# Altium schematic sheet XOR_LCD.SchDoc: XOR_LCD LCD Biasing Circuit
size B; DocumentNumber: 2; SheetNumber: 2; SheetTotal: 2; Address1: L3, 12a Rodborough Rd; Address2: Frenchs Forest; Address3: NSW; Address4: Australia 2086; Organization: Altium Limited
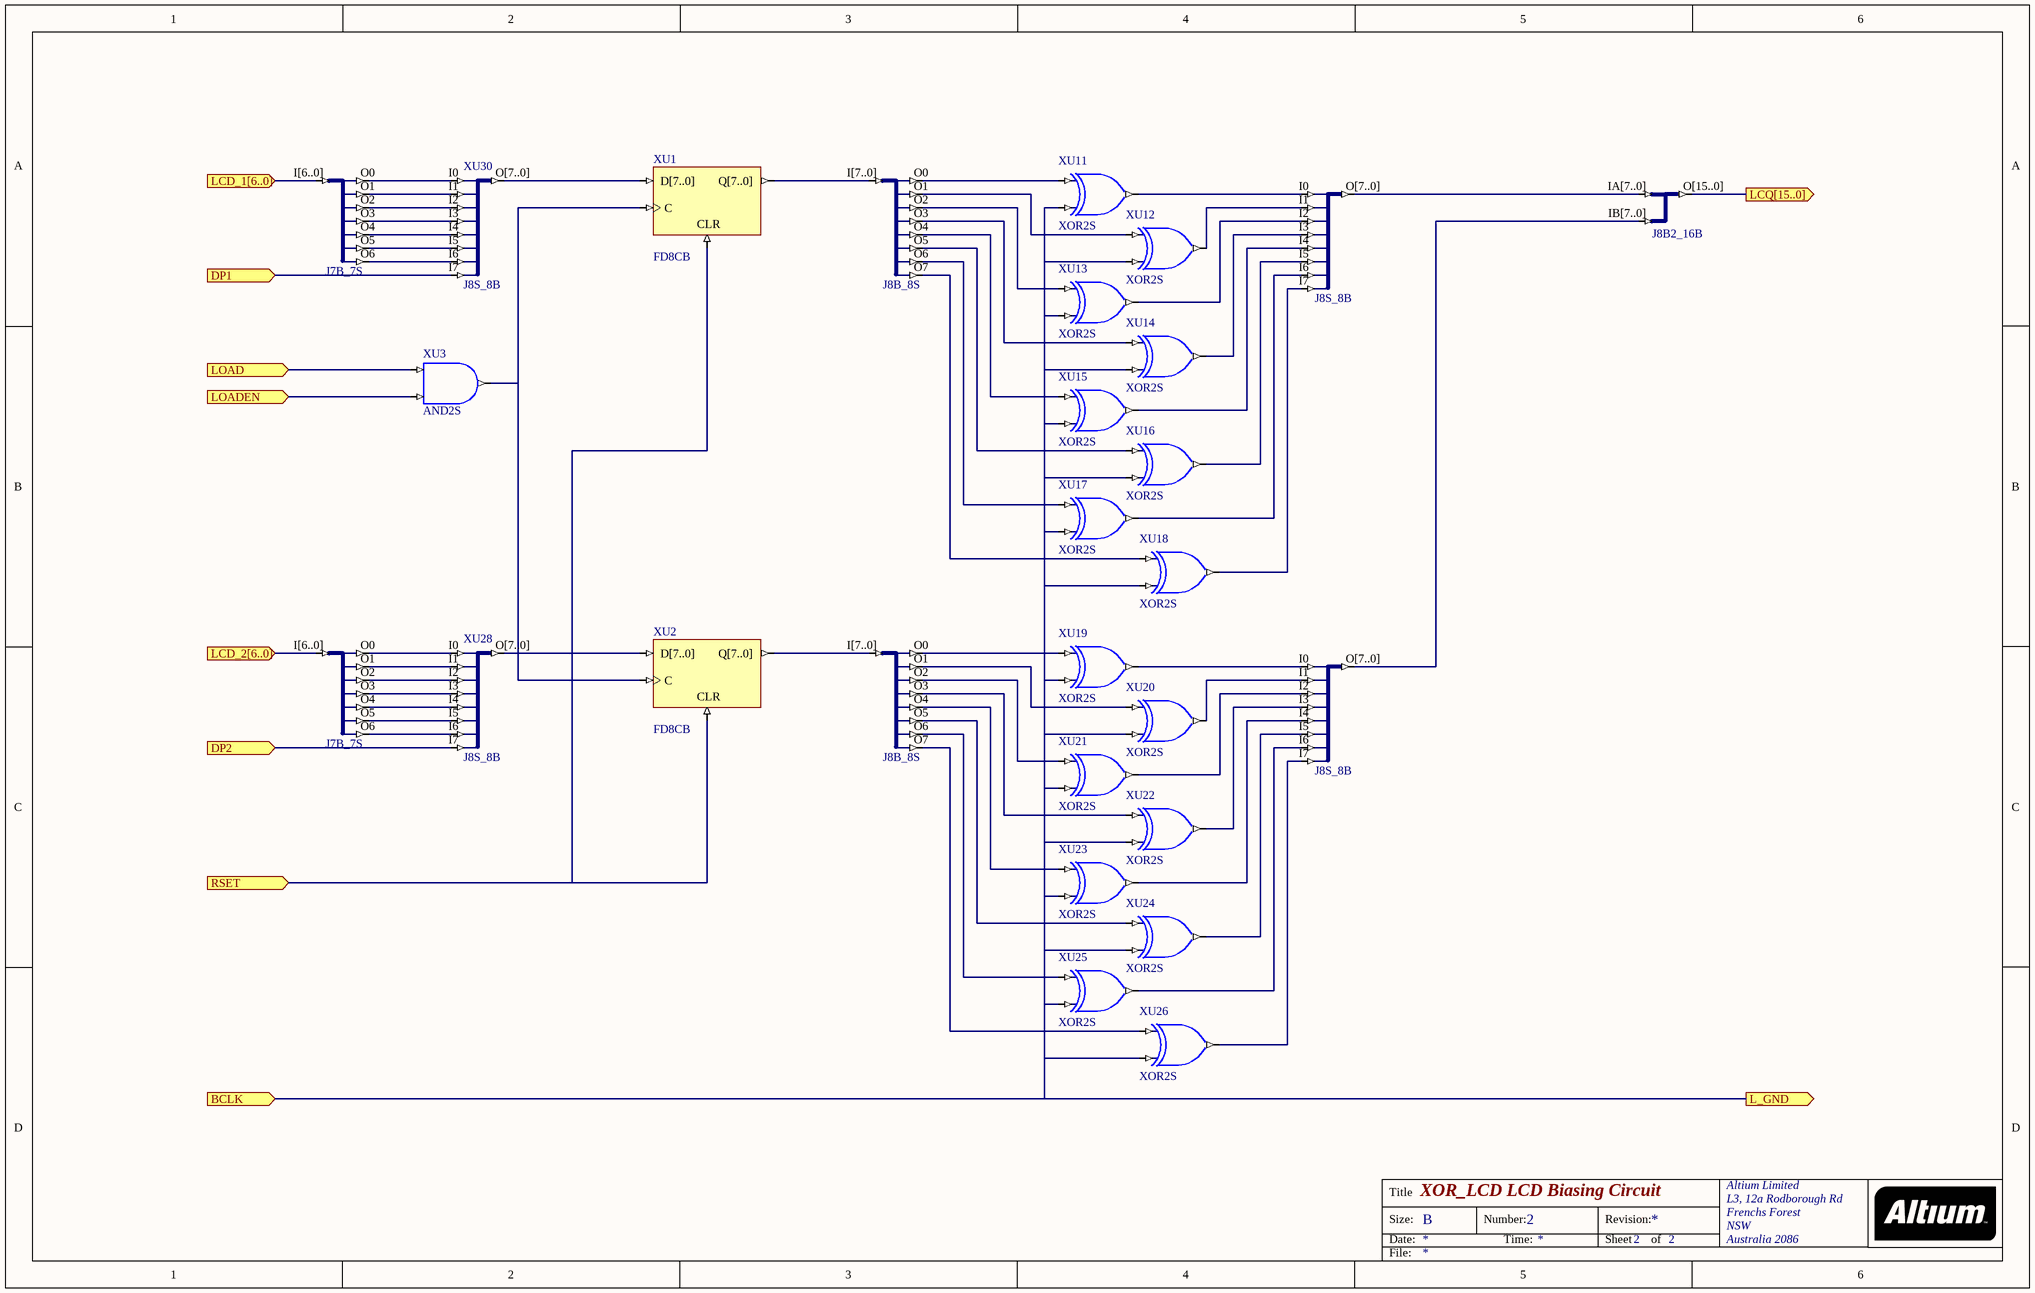
[diagram p0: XOR_LCD.SchDoc]

## Parts
XU1  FD8CB
XU2  FD8CB
XU3  AND2S
XU5  J8B_8S
XU6  J8B_8S
XU7  J8S_8B
XU9  J8S_8B
XU10  J8B2_16B
XU11  XOR2S
XU12  XOR2S
XU13  XOR2S
XU14  XOR2S
XU15  XOR2S
XU16  XOR2S
XU17  XOR2S
XU18  XOR2S
XU19  XOR2S
XU20  XOR2S
XU21  XOR2S
XU22  XOR2S
XU23  XOR2S
XU24  XOR2S
XU25  XOR2S
XU26  XOR2S
XU27  J7B_7S
XU28  J8S_8B
XU29  J7B_7S
XU30  J8S_8B

## Ports
BCLK (in), DP1 (in), DP2 (in), L_GND (out), LCD_1[6..0] (in), LCD_2[6..0] (in), LCQ[15..0] (out), LOAD (in), LOADEN (in), RSET (in)

## Nets
BCLK: XU11.I1 XU12.I1 XU13.I1 XU14.I1 XU15.I1 XU16.I1 XU17.I1 XU18.I1 XU19.I1 XU20.I1 XU21.I1 XU22.I1 XU23.I1 XU24.I1 XU25.I1 XU26.I1 ; port L_GND, port BCLK
DP1: XU30.I7 ; port DP1
DP2: XU28.I7 ; port DP2
LCD_1[6..0]: XU29.I[6..0] ; port LCD_1[6..0]
LCD_2[6..0]: XU27.I[6..0] ; port LCD_2[6..0]
LCQ[15..0]: XU10.O[15..0] ; port LCQ[15..0]
LOAD: XU3.I0 ; port LOAD
LOADEN: XU3.I1 ; port LOADEN
RSET: XU1.CLR XU2.CLR ; port RSET
NetXU1_C: XU1.C XU2.C XU3.O
NetXU1_D[7..0]: XU1.D[7..0] XU30.O[7..0]
NetXU1_Q[7..0]: XU1.Q[7..0] XU5.I[7..0]
NetXU2_D[7..0]: XU2.D[7..0] XU28.O[7..0]
NetXU2_Q[7..0]: XU2.Q[7..0] XU6.I[7..0]
NetXU5_O0: XU5.O0 XU11.I0
NetXU5_O1: XU5.O1 XU12.I0
NetXU5_O2: XU5.O2 XU13.I0
NetXU5_O3: XU5.O3 XU14.I0
NetXU5_O4: XU5.O4 XU15.I0
NetXU5_O5: XU5.O5 XU16.I0
NetXU5_O6: XU5.O6 XU17.I0
NetXU5_O7: XU5.O7 XU18.I0
NetXU6_O0: XU6.O0 XU19.I0
NetXU6_O1: XU6.O1 XU20.I0
NetXU6_O2: XU6.O2 XU21.I0
NetXU6_O3: XU6.O3 XU22.I0
NetXU6_O4: XU6.O4 XU23.I0
NetXU6_O5: XU6.O5 XU24.I0
NetXU6_O6: XU6.O6 XU25.I0
NetXU6_O7: XU6.O7 XU26.I0
NetXU7_I0: XU7.I0 XU11.O
NetXU7_I1: XU7.I1 XU12.O
NetXU7_I2: XU7.I2 XU13.O
NetXU7_I3: XU7.I3 XU14.O
NetXU7_I4: XU7.I4 XU15.O
NetXU7_I5: XU7.I5 XU16.O
NetXU7_I6: XU7.I6 XU17.O
NetXU7_I7: XU7.I7 XU18.O
NetXU7_O[7..0]: XU7.O[7..0] XU10.IA[7..0]
NetXU9_I0: XU9.I0 XU19.O
NetXU9_I1: XU9.I1 XU20.O
NetXU9_I2: XU9.I2 XU21.O
NetXU9_I3: XU9.I3 XU22.O
NetXU9_I4: XU9.I4 XU23.O
NetXU9_I5: XU9.I5 XU24.O
NetXU9_I6: XU9.I6 XU25.O
NetXU9_I7: XU9.I7 XU26.O
NetXU9_O[7..0]: XU9.O[7..0] XU10.IB[7..0]
NetXU27_O0: XU27.O0 XU28.I0
NetXU27_O1: XU27.O1 XU28.I1
NetXU27_O2: XU27.O2 XU28.I2
NetXU27_O3: XU27.O3 XU28.I3
NetXU27_O4: XU27.O4 XU28.I4
NetXU27_O5: XU27.O5 XU28.I5
NetXU27_O6: XU27.O6 XU28.I6
NetXU29_O0: XU29.O0 XU30.I0
NetXU29_O1: XU29.O1 XU30.I1
NetXU29_O2: XU29.O2 XU30.I2
NetXU29_O3: XU29.O3 XU30.I3
NetXU29_O4: XU29.O4 XU30.I4
NetXU29_O5: XU29.O5 XU30.I5
NetXU29_O6: XU29.O6 XU30.I6

## Notes on the sheet
- Title
- Size:
- Date:
- B
- Number:
- Time:
- Revision:
- Sheet
- of
- File:

## Library data of the parts
XU1 XU2 = FD8CB: 8-Bit D-Type Flip-Flop with Asynchronous Clear, Bus Version; SubClass: FD; ClockTrigger: Rising; PortSize: 8; ArchiveName: GENERIC; VHDLIB_SIM: GENERIC_LIB; Published: 29-Jan-2004; Publisher: Altium Limited; LastRevisionNo: 1.00.00; HelpURL: CR0118 FPGA Generic Library Guide.pdf#page=171; FunctionalClass: Flip-Flop; Reset: Asynchronous; PortStyle: Bus Version
XU3 = AND2S: 2-Input AND Gate, Single Pin Version; XilinxEquivalent: AND2; FunctionalClass: Logic Primitive; PortSize: 2; ArchiveName: GENERIC; VHDLIB_SIM: GENERIC_LIB; Published: 29-Jan-2004; Publisher: Altium Limited; LastRevisionNo: 1.00.00; HelpURL: CR0118 FPGA Generic Library Guide.pdf#page=113; SubClass: AND; PortStyle: Single Pin Version
XU5 XU6 = J8B_8S: 8-Bit input bus to 8 single pin outputs; FunctionalClass: Bus Joiner; PortSize: 8; ArchiveName: GENERIC; VHDLIB_SIM: GENERIC_LIB; Published: 29-Jan-2004; Publisher: Altium Limited; LastRevisionNo: 1.00.00; HelpURL: CR0118 FPGA Generic Library Guide.pdf#page=303
XU7 XU9 XU28 XU30 = J8S_8B: 8 Single pin inputs to single 8-Bit output bus; FunctionalClass: Bus Joiner; PortSize: 8; ArchiveName: GENERIC; VHDLIB_SIM: GENERIC_LIB; Published: 29-Jan-2004; Publisher: Altium Limited; LastRevisionNo: 1.00.00; HelpURL: CR0118 FPGA Generic Library Guide.pdf#page=305
XU10 = J8B2_16B: 2 x 8-Bit input bus to 1 x 16-bit output bus; FunctionalClass: Bus Joiner; PortSize: 8; ArchiveName: GENERIC; VHDLIB_SIM: GENERIC_LIB; Published: 29-Jan-2004; Publisher: Altium Limited; LastRevisionNo: 1.00.00; HelpURL: CR0118 FPGA Generic Library Guide.pdf#page=301
XU11-XU26 = XOR2S: 2-Input Exclusive-OR Gate, Single Pin Version; XilinxEquivalent: XOR2; FunctionalClass: Logic Primitive; SubClass: XOR; PortSize: 2; ArchiveName: GENERIC; VHDLIB_SIM: GENERIC_LIB; Published: 29-Jan-2004; Publisher: Altium Limited; LastRevisionNo: 1.00.00; HelpURL: CR0118 FPGA Generic Library Guide.pdf#page=437; PortStyle: Single Pin Version
XU27 XU29 = J7B_7S: 7-Bit input bus to 7 Single pin outputs; FunctionalClass: Bus Joiner; PortSize: 7; ArchiveName: GENERIC; VHDLIB_SIM: GENERIC_LIB; Published: 29-Jan-2004; Publisher: Altium Limited; LastRevisionNo: 1.00.00; HelpURL: CR0118 FPGA Generic Library Guide.pdf#page=303